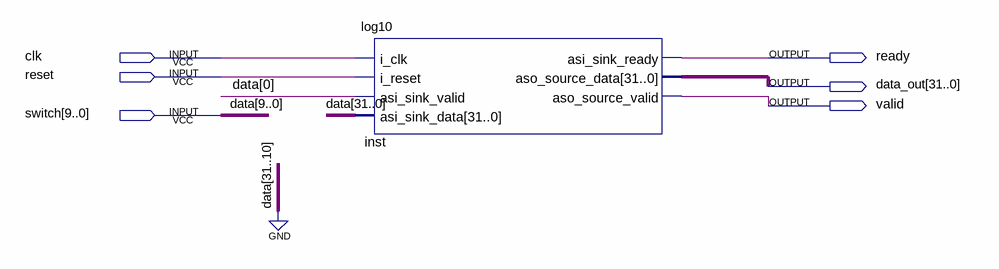
[diagram p0: schematic sheet]
// Quartus schematic top.bdf as structural Verilog: 1 symbols, 6 pins
module top (
  input  clk,
  input  reset,
  input  [9:0] switch,
  output ready,
  output [31:0] data_out,
  output valid
);

  log10 inst (
    .i_clk(clk), .i_reset(reset), .asi_sink_valid(switch[0]), .asi_sink_data({{22{1'b0}}, switch}),
    .asi_sink_ready(ready), .aso_source_data(data_out), .aso_source_valid(valid));

  // Other names for the same wires on the sheet: data[9:0] = switch
endmodule
